# EAGLE schematic KickerBoard (EAGLE 7.2.0)
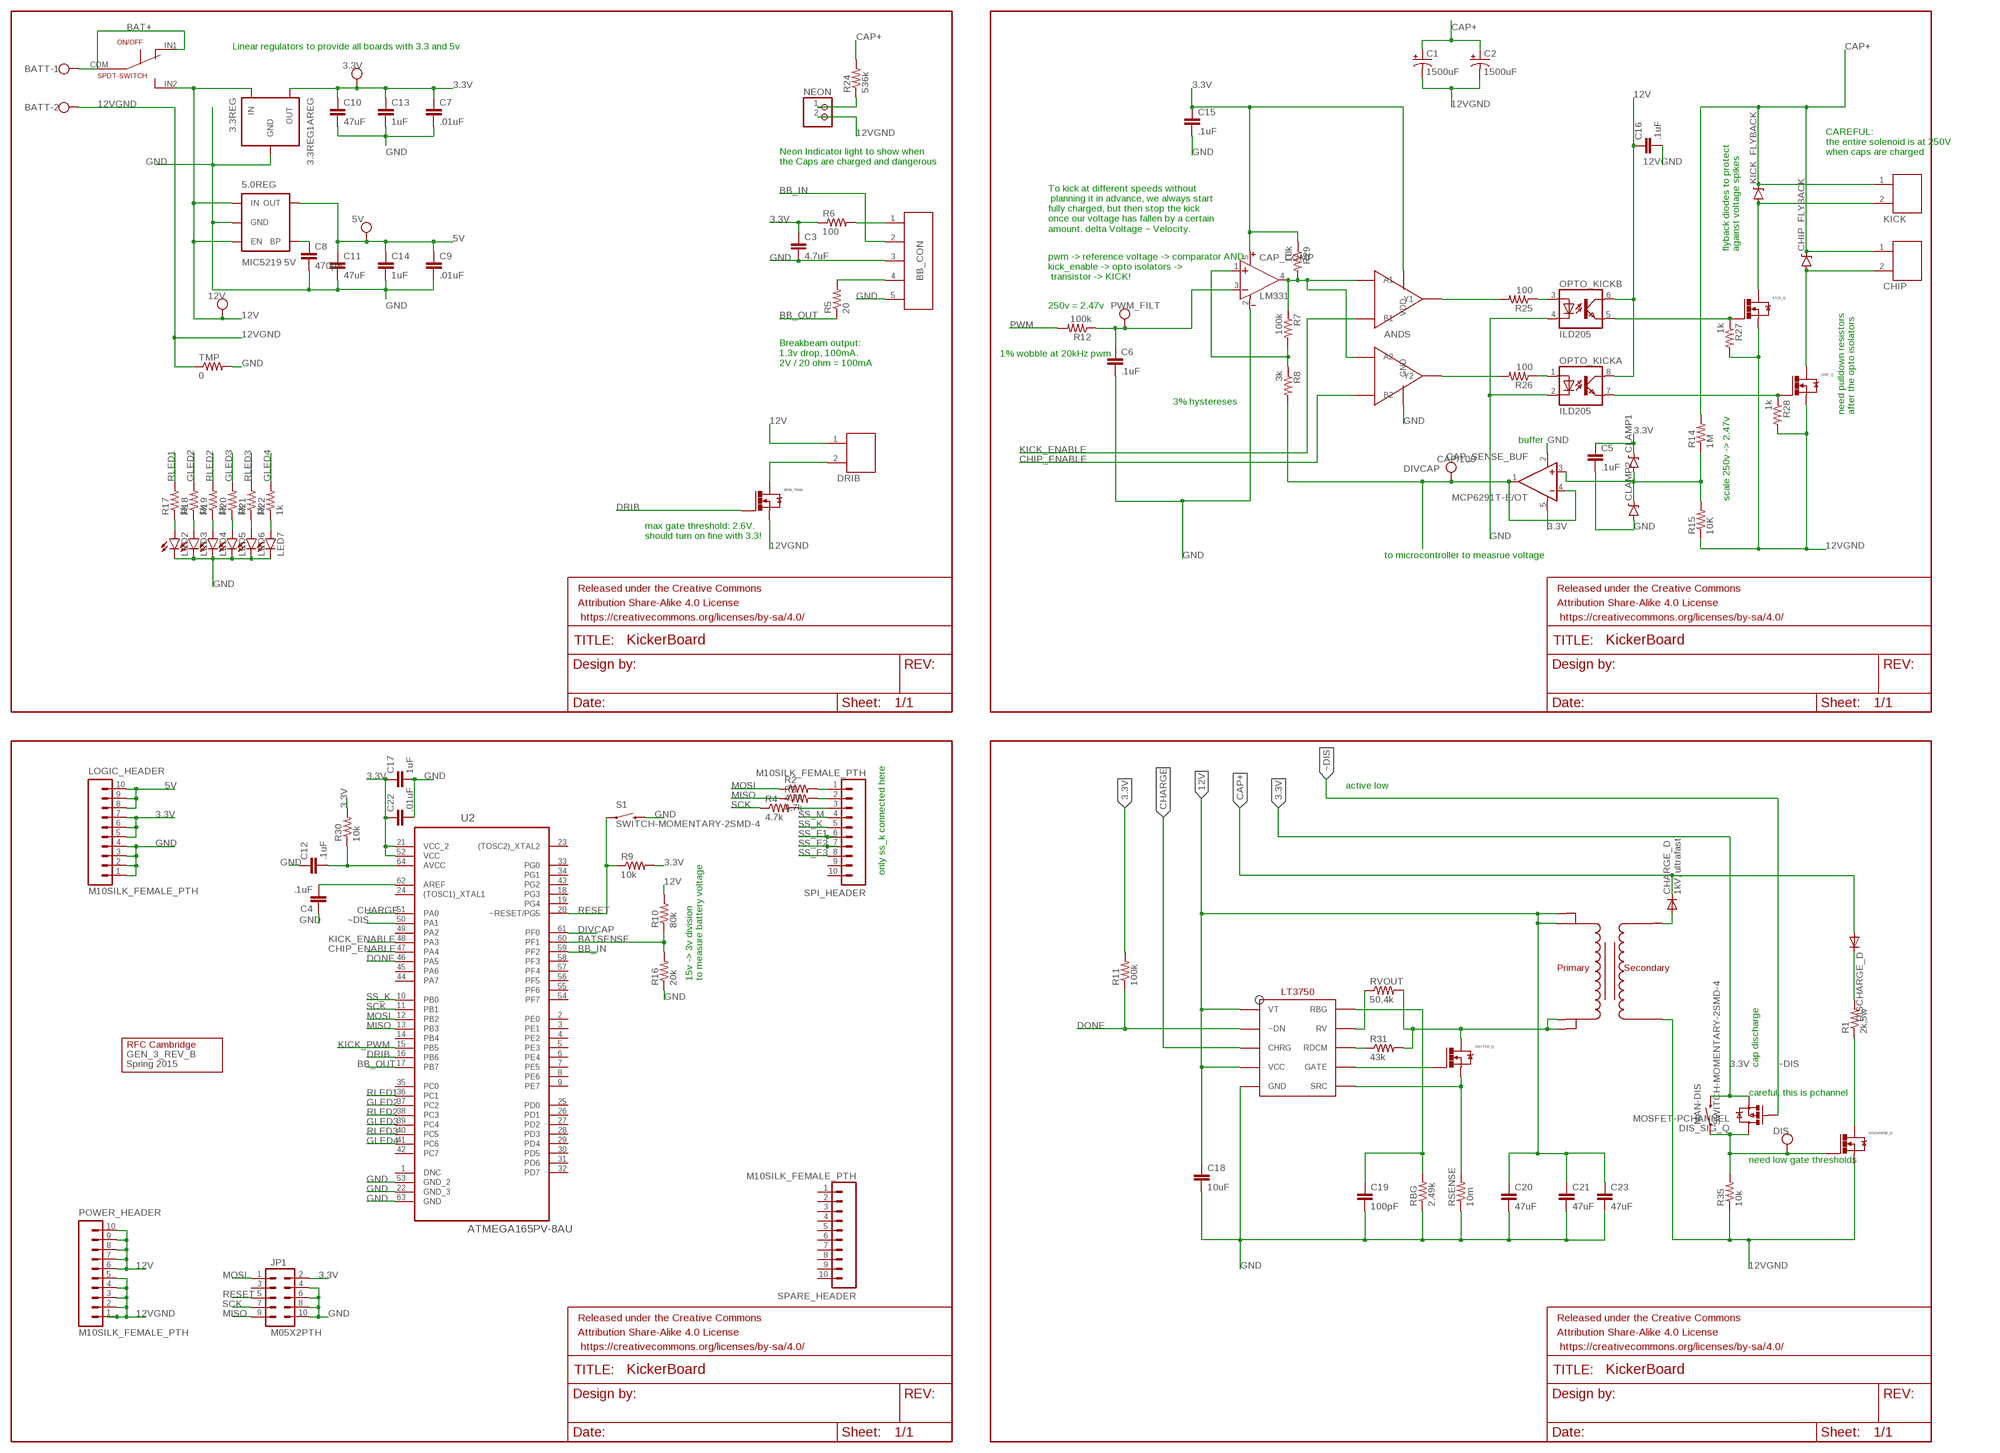
[diagram p0: schematic, sheet 1]

## Parts
3.3REG  3.3REG1AREG  [DPAK]
3.3V  TEST_PT  [TESTING_PT]
5.0REG  MIC5219 5V  V_REG_MIC52195V  [SOT23-5]
5V  TEST_PT  [TESTING_PT]
12V  TEST_PT  [TESTING_PT]
ANDS  AND-DUAL  [TSSOP8]
BATT  W237-102  [W237-102]
BB_CON  JST-5  [JST-5-2MM]
C1  1500uF  CPOL-USE10-35  [EB35D]
C2  1500uF  CPOL-USE10-35  [EB35D]
C3  4.7uF  CAP0805  [0805]
C4  .1uF  CAP0805  [0805]
C5  .1uF  CAP0805  [0805]
C6  .1uF  CAP0805  [0805]
C7  .01uF  CAP0805  [0805]
C8  470pF  CAP0805  [0805]
C9  .01uF  CAP0805  [0805]
C10  47uF  CAP1206  [1206]
C11  47uF  CAP1206  [1206]
C12  .1uF  CAP0805  [0805]
C13  1uF  CAP0805  [0805]
C14  1uF  CAP0805  [0805]
C15  .1uF  CAP0805  [0805]
C16  .1uF  CAP0805  [0805]
C17  1uF  CAP0805  [0805]
C18  10uF  CAP0805  [0805]
C19  100pF  CAP0805  [0805]
C20  47uF  CAP1206  [1206]
C21  47uF  CAP1206  [1206]
C22  .01uF  CAP0805  [0805]
C23  47uF  CAP1206  [1206]
CAP/100  TEST_PT  [TESTING_PT]
CAP_COMP  LM331  [SOT23-5]
CAP_SENSE_BUF  MCP6291T-E/OT  [SOT23-5]
CHARGE_D  1kV, ultrafast  DIODE-DO214AC  [DO214AC]
CHARGE_U  LT3750  [10-MSOP]
CHIP  JST-22MM  [JST-2-2MM]
CHIP_FLYBACK  DIODE-ZENERDO214AB  [DO214AB]
CHIP_Q  N-MOSFETDPAK  [DPAK]
CLAMP1  DIODE-ZENERDO214AC  [DO214AC]
CLAMP2  DIODE-ZENERDO214AC  [DO214AC]
DIS  TEST_PT  [TESTING_PT]
DIS_SIG_Q  MOSFET-PCHANNEL  [SOT23-3]
DISCHARGE_D  DIODE-DO214AA  [DO214AA]
DISCHARGE_Q  N-MOSFETDPAK  [DPAK]
DRIB  JST-22MM  [JST-2-2MM]
DRIB_TRAN  N-MOSFETDPAK  [DPAK]
FRAME1  FRAME-LETTER  [CREATIVE_COMMONS]
FRAME2  FRAME-LETTER  [CREATIVE_COMMONS]
FRAME3  FRAME-LETTER  [CREATIVE_COMMONS]
FRAME4  FRAME-LETTER  [CREATIVE_COMMONS]
GEN_3_REV_B  Spring 2015  LOGO  [LOGO]
JP1  M05X2PTH  [AVR_ICSP]
KICK  JST-22MM  [JST-2-2MM]
KICK_FLYBACK  DIODE-ZENERDO214AB  [DO214AB]
KICK_Q  N-MOSFETDPAK  [DPAK]
LED2  LED1206  [LED-1206]
LED3  LED1206  [LED-1206]
LED4  LED1206  [LED-1206]
LED5  LED1206  [LED-1206]
LED6  LED1206  [LED-1206]
LED7  LED1206  [LED-1206]
LOGIC_HEADER  M10SILK_FEMALE_PTH  [1X10]
MAN-DIS  SWITCH-MOMENTARY-2SMD-4  [TACTILE_SWITCH_TALL]
NEON  PINHD-1X2  [1X02]
ON/OFF  SPDT-SWITCH  [CK_SWITCH]
OPTO_KICK  ILD205  [SOIC08]
POWER_HEADER  M10SILK_FEMALE_PTH  [1X10]
PWM_FILT  TEST_PT  [TESTING_PT]
R1  2k,5w  RESISTOR  [5WRESISTOR]
R2  4.7k  RESISTOR0805-RES  [0805]
R3  4.7k  RESISTOR0805-RES  [0805]
R4  4.7k  RESISTOR0805-RES  [0805]
R5  20  RESISTOR0805-RES  [0805]
R6  100  RESISTOR0805-RES  [0805]
R7  100k  RESISTOR0805-RES  [0805]
R8  3k  RESISTOR0805-RES  [0805]
R9  10k  RESISTOR0805-RES  [0805]
R10  80k  RESISTOR0805-RES  [0805]
R11  100k  RESISTOR0805-RES  [0805]
R12  100k  RESISTOR0805-RES  [0805]
R14  1M  RESISTOR0805-RES  [0805]
R15  10K  RESISTOR0805-RES  [0805]
R16  20k  RESISTOR0805-RES  [0805]
R17  1k  RESISTOR0805-RES  [0805]
R18  1k  RESISTOR0805-RES  [0805]
R19  1k  RESISTOR0805-RES  [0805]
R20  1k  RESISTOR0805-RES  [0805]
R21  1k  RESISTOR0805-RES  [0805]
R22  1k  RESISTOR0805-RES  [0805]
R24  536k  RESISTOR0805-RES  [0805]
R25  100  RESISTOR0805-RES  [0805]
R26  100  RESISTOR0805-RES  [0805]
R27  1k  RESISTOR0805-RES  [0805]
R28  1k  RESISTOR0805-RES  [0805]
R29  10k  RESISTOR0805-RES  [0805]
R30  10k  RESISTOR0805-RES  [0805]
R31  43k  RESISTOR0805-RES  [0805]
R35  10k  RESISTOR0805-RES  [0805]
RBG  2.49k  RESISTOR0805-RES  [0805]
RSENSE  10m  RESISTOR2512  [R2512]
RVOUT  50.4k  RESISTOR0805-RES  [0805]
S1  SWITCH-MOMENTARY-2SMD-4  [TACTILE_SWITCH_TALL]
SPARE_HEADER  M10SILK_FEMALE_PTH  [1X10]
SPI_HEADER  M10SILK_FEMALE_PTH  [1X10]
SWITCH_Q  N-MOSFETDPAK  [DPAK]
TMP  0  RESISTOR0805-RES  [0805]
U2  ATMEGA165PV-8AU  [QFP80P1600X1600X120-64N]
U$1  32052-TRANSFORMER  [10-TRANSFORMER]

## Nets
3.3V: 3.3REG.SOURCE(OUT) 3.3V.P$1 ANDS.P$8(VDD) C3.1 C5.1 C7.1 C10.1 C13.1 C15.1 C17.1 C22.1 CAP_COMP.5(V+) CAP_SENSE_BUF.5(V+) CLAMP1.C DIS_SIG_Q.2(S) JP1.2 LOGIC_HEADER.5 LOGIC_HEADER.6 LOGIC_HEADER.7 MAN-DIS.B2 R6.1 R9.2 R11.2 R29.1 R30.2 U2.21(VCC_2) U2.52(VCC)
5V: 5.0REG.5(OUT) 5V.P$1 C9.1 C11.1 C14.1 LOGIC_HEADER.8 LOGIC_HEADER.9 LOGIC_HEADER.10
12V: 3.3REG.GATE(IN) 5.0REG.1(IN) 5.0REG.3(EN) 12V.P$1 C16.1 C18.1 C20.1 C21.1 C23.1 CHARGE_U.P$1(VT) CHARGE_U.P$4(VCC) DRIB.1 ON/OFF.IN2(P2) OPTO_KICK.6(B:COL) OPTO_KICK.8(A:COL) POWER_HEADER.6 POWER_HEADER.7 POWER_HEADER.8 POWER_HEADER.9 POWER_HEADER.10 R10.2 U$1.P$4 U$1.P$5
12VGND: BATT.2 C1.- C2.- C16.2 CHIP_Q.SOURCE(S) DISCHARGE_Q.SOURCE(S) DRIB_TRAN.SOURCE(S) KICK_Q.SOURCE(S) NEON.2 POWER_HEADER.1 POWER_HEADER.2 POWER_HEADER.3 POWER_HEADER.4 POWER_HEADER.5 R15.1 R27.2 R28.2 R35.1 TMP.1 U$1.P$10
AND_CHIP: ANDS.P$3(Y2) R26.2
AND_KICK: ANDS.P$7(Y1) R25.2
AREF: C4.2 U2.62(AREF)
AVCC: C12.2 R30.1 U2.64(AVCC)
BAT+: BATT.1 ON/OFF.COM ON/OFF.IN1(P1)
BATSENSE: R10.1 R16.2 U2.60(PF1)
BB_IN: BB_CON.2 U2.59(PF2)
BB_OUT: R5.1 U2.17(PB7)
CAP+: C1.+ C2.+ CHARGE_D.C CHIP.1 CHIP_FLYBACK.CATHODE(C) DISCHARGE_D.A KICK.1 KICK_FLYBACK.CATHODE(C) R14.2 R24.2
CHARGE: CHARGE_U.P$3(CHRG) U2.51(PA0)
CHIP_ENABLE: ANDS.P$6(B2) U2.47(PA4)
COMP_OUT: ANDS.P$1(A1) ANDS.P$5(A2) CAP_COMP.4(OUT) R7.1 R29.2
DISCHARGE_GATE: DIS.P$1 DIS_SIG_Q.3(D) DISCHARGE_Q.GATE(G) MAN-DIS.A2 R35.2
DIVCAP: CAP/100.P$1 CAP_SENSE_BUF.1(OUT) CAP_SENSE_BUF.4(-IN) R8.2 U2.61(PF0)
DONE: CHARGE_U.P$2(~DN) R11.1 U2.46(PA5)
DRIB: DRIB_TRAN.GATE(G) U2.16(PB6)
GATE_CHIP: CHIP_Q.GATE(G) OPTO_KICK.7(A:EMIT) R28.1
GATE_KICK: KICK_Q.GATE(G) OPTO_KICK.5(B:EMIT) R27.1
GLED2: R18.2 U2.37(PC2)
GLED3: R20.2 U2.39(PC4)
GLED4: R22.2 U2.41(PC6)
GND: 3.3REG.DRAIN(GND) 5.0REG.2(GND) ANDS.P$4(GND) BB_CON.3 BB_CON.5 C3.2 C4.1 C5.2 C6.2 C7.2 C8.2 C9.2 C10.2 C11.2 C12.1 C13.2 C14.2 C15.2 C17.2 C18.2 C19.2 C20.2 C21.2 C22.2 C23.2 CAP_COMP.2(V-) CAP_SENSE_BUF.2(V-) CHARGE_U.P$5(GND) CLAMP2.A JP1.4 JP1.6 JP1.8 JP1.10 LED2.C LED3.C LED4.C LED5.C LED6.C LED7.C LOGIC_HEADER.1 LOGIC_HEADER.2 LOGIC_HEADER.3 LOGIC_HEADER.4 OPTO_KICK.2(A:C) OPTO_KICK.4(B:C) R16.1 RBG.1 RSENSE.1 S1.B2 TMP.2 U2.22(GND_3) U2.53(GND_2) U2.63(GND)
HYSTERESIS: CAP_COMP.1(IN+) R7.2 R8.1
KICK_ENABLE: ANDS.P$2(B1) U2.48(PA3)
KICK_PWM: U2.15(PB5)
MISO: JP1.9 R3.1 U2.13(PB3)
MOSI: JP1.1 R2.1 U2.12(PB2)
N$1: C6.1 CAP_COMP.3(IN-) PWM_FILT.P$1 R12.1
N$2: LED2.A R17.1
N$3: R3.2 SPI_HEADER.2
N$4: R4.2 SPI_HEADER.3
N$5: R31.2 RVOUT.2 SWITCH_Q.DRAIN(D) U$1.P$6 U$1.P$7
N$6: C19.1 CHARGE_U.P$10(RBG) RBG.2
N$7: CHARGE_U.P$9(RV) RVOUT.1
N$9: CHARGE_U.P$7(GATE) SWITCH_Q.GATE(G)
N$10: CHARGE_U.P$8(RDCM) R31.1
N$12: R2.2 SPI_HEADER.1
N$13: DISCHARGE_D.C R1.P$2
N$16: 5.0REG.4(BP) C8.1
N$17: DISCHARGE_Q.DRAIN(D) R1.P$1
N$20: OPTO_KICK.3(B:A) R25.1
N$21: LED3.A R18.1
N$22: LED4.A R19.1
N$24: CHARGE_U.P$6(SRC) RSENSE.2 SWITCH_Q.SOURCE(S)
N$25: LED5.A R20.1
N$26: LED6.A R21.1
N$31: LED7.A R22.1
N$32: BB_CON.4 R5.2
N$33: KICK.2 KICK_FLYBACK.ANODE(A) KICK_Q.DRAIN(D)
N$34: CHIP.2 CHIP_FLYBACK.ANODE(A) CHIP_Q.DRAIN(D)
N$36: OPTO_KICK.1(A:A) R26.1
N$40: BB_CON.1 R6.2
PWM: R12.2
RESET: JP1.5 R9.1 S1.A2 U2.20(~RESET/PG5)
RLED1: R17.2 U2.36(PC1)
RLED2: R19.2 U2.38(PC3)
RLED3: R21.2 U2.40(PC5)
SCK: JP1.7 R4.1 U2.11(PB1)
SS_E1: SPI_HEADER.6
SS_E2: SPI_HEADER.7
SS_E3: SPI_HEADER.8
SS_K: SPI_HEADER.5 U2.10(PB0)
SS_M: SPI_HEADER.4
TO_DRIB: DRIB.2 DRIB_TRAN.DRAIN(D)
TO_NEON: NEON.1 R24.1
TRANS_OUT: CHARGE_D.A U$1.P$1
UNBUF_DIVCAP: CAP_SENSE_BUF.3(+IN) CLAMP1.A CLAMP2.C R14.1 R15.2
~DIS: DIS_SIG_Q.1(G) U2.50(PA1)
Unconnected: JP1.3 SPARE_HEADER.1 SPARE_HEADER.2 SPARE_HEADER.3 SPARE_HEADER.4 SPARE_HEADER.5 SPARE_HEADER.6 SPARE_HEADER.7 SPARE_HEADER.8 SPARE_HEADER.9 SPARE_HEADER.10 SPI_HEADER.9 SPI_HEADER.10 U2.1(DNC) U2.2(PE0) U2.3(PE1) U2.4(PE2) U2.5(PE3) U2.6(PE4) U2.7(PE5) U2.8(PE6) U2.9(PE7) U2.14(PB4) U2.18(PG3) U2.19(PG4) U2.23((TOSC2)_XTAL2) U2.24((TOSC1)_XTAL1) U2.25(PD0) U2.26(PD1) U2.27(PD2) U2.28(PD3) U2.29(PD4) U2.30(PD5) U2.31(PD6) U2.32(PD7) U2.33(PG0) U2.34(PG1) U2.35(PC0) U2.42(PC7) U2.43(PG2) U2.44(PA7) U2.45(PA6) U2.49(PA2) U2.54(PF7) U2.55(PF6) U2.56(PF5) U2.57(PF4) U2.58(PF3)

## Notes on the sheet
- Linear regulators to provide all boards with 3.3 and 5v
- CAREFUL:
  the entire solenoid is at 250V 
  when caps are charged
- Neon Indicator light to show when
  the Caps are charged and dangerous
- To kick at different speeds without
   planning it in advance, we always start 
  fully charged, but then stop the kick 
  once our voltage has fallen by a certain 
  amount. delta Voltage ~ Velocity.
- flyback diodes to protect
  against voltage spikes
- pwm -> reference voltage -> comparator AND 
  kick_enable -> opto isolators ->
   transistor -> KICK!
- 250v = 2.47v
- 1% wobble at 20kHz pwm
- Breakbeam output:
  1.3v drop, 100mA.
  2V / 20 ohm = 100mA
- 3% hystereses
- need pulldown resistors 
  after the opto isolators
- buffer
- scale 250v -> 2.47v
- max gate threshold: 2.6V. 
  should turn on fine with 3.3!
- to microcontroller to measrue voltage
- active low
- only ss_k connected here
- 15v -> 3v division
  to measure battery voltage
- cap discharge
- careful, this is pchannel
- need low gate thresholds

## Library data of the parts
3.3REG = gen3:3.3REG1A
3.3V 5V 12V CAP/100 DIS PWM_FILT = gen3:TEST_PT: Testing Point Use to probe a signal
5.0REG = SparkFun-PowerIC:V_REG_MIC5219: V_REG MIC5219 Standard 3.3V and 5V 500mA LDO voltage regulator in SOT-23 layout. Micrel part MIC5219. BP (by-pass) pin is used to lower output noise with 470pF cap, may be left open.; PROD_ID: VREG-10107
ANDS = gen3:AND-DUAL
BATT = con-wago-500:W237-102: WAGO SCREW CLAMP; MPN: 237-102; OC_FARNELL: unknown; OC_NEWARK: 70K9898
BB_CON = gen3:JST-5
C1 C2 = rcl:CPOL-US: POLARIZED CAPACITOR, American symbol
C3-C23 = SparkFun-Capacitors:CAP: Capacitor Standard 0603 ceramic capacitor, and 0.1" leaded capacitor.
CAP_COMP = gen3:LM331: LM331 Single Comparator Digikey: 296-6633-1-ND
CAP_SENSE_BUF = SparkFun-AnalogIC:MCP6291: Rail to rail OpAmp with 10MHz GBP; PROD_ID: IC-11991
CHARGE_D DISCHARGE_D = gen3:DIODE-: DIODE
CHARGE_U = kickerchips:LT3750
CHIP DRIB KICK = gen3:JST-2
CHIP_FLYBACK CLAMP1 CLAMP2 KICK_FLYBACK = gen3:DIODE-ZENER: Zener Diode Production Part - 8199 3.4V Zener Voltage
CHIP_Q DISCHARGE_Q DRIB_TRAN KICK_Q SWITCH_Q = gen3:N-MOSFET: N-Channel Power Mosfet
DIS_SIG_Q = SparkFun-DiscreteSemi:MOSFET-PCHANNEL: Generic PMOSFET IRLML2244 - TRANS-11153 (SOT-23 -20V -4.3A) (1.Gate 2.Source 3.Drain) FQP27P06 - COM-10349 <http://www.sparkfun.com/products/10349> (TO-220 -60V -27A) (1.Gate 2.Source 3.Drain); PROD_ID: TRANS-08285
FRAME1-FRAME4 = SparkFun-Aesthetics:FRAME-LETTER: Schematic Frame Standard 8.5x11 US Letter frame
GEN_3_REV_B = gen3:LOGO
JP1 = SparkFun-Connectors:M05X2: Header 5x2 Standard 10-pin dual row 0.1" header. Commonly used with AVR-ISP. Use with Spark Fun Electronics SKU: PRT-00778
LED2-LED7 = SparkFun-LED:LED: LEDs Standard schematic elements and footprints for 5mm, 3mm, 1206, and 0603 sized LEDs. 5mm - Spark Fun Electronics SKU : COM-00529 (and others)
LOGIC_HEADER POWER_HEADER SPARE_HEADER SPI_HEADER = SparkFun-Connectors:M10: Header 10 Standard 10-pin 0.1" header. Use with straight break away headers (SKU : PRT-00116), right angle break away headers (PRT-00553), swiss pins (PRT-00743), machine pins (PRT-00117), and female headers (PRT-00115).; PROD_ID: CONN-11563
MAN-DIS S1 = SparkFun-Electromechanical:SWITCH-MOMENTARY-2: Various NO switches- pushbuttons, reed, etc; PROD_ID: SWCH-11966
NEON = pinhead:PINHD-1X2: PIN HEADER
ON/OFF = gen3:SPDT-SWITCH
OPTO_KICK = optocoupler:ILD2*: Siemens ILD205/206/207/211/213/217 DUAL PHOTOTRANSISTOR SMALL OUTLINE SURFACE MOUNT OPTOCOUPLER Source: 153385-da-01-en-Optocoupler_ILD205-T.pdf; MF: VISHAY/TELEFUNKEN; MPN: ILD205T; OC_FARNELL: 1469512; OC_NEWARK: 20H8678
R1 = gen3:RESISTOR: Resistor Basic schematic elements and footprints for 0603, 1206, and PTH resistors.
R2-R12 R16-R22 R24-R31 R35 RBG RSENSE RVOUT TMP = SparkFun-Passives:RESISTOR: Resistor Basic schematic elements and footprints for 0603, 1206, and PTH resistors.
R14 R15 = SparkFun-Resistors:RESISTOR: Resistor Basic schematic elements and footprints for 0603, 1206, and PTH resistors.
U2 = Atmel_By_element14_Batch_1-00:ATMEGA165PV-8AU: 8-bit Microcontroller with 16K Bytes In-System Programmable Flash; MPN: ATMEGA165PV-8AU; OC_FARNELL: 1455104; OC_NEWARK: 58M3730; PACKAGE: TQFP-64; SUPPLIER: Atmel
U$1 = gen3:32052-TRANSFORMER: 32052 flyback transformer digikey #: 732-2129-1-ND